# Altium project GSH_Bed_v1.0.PrjPcb
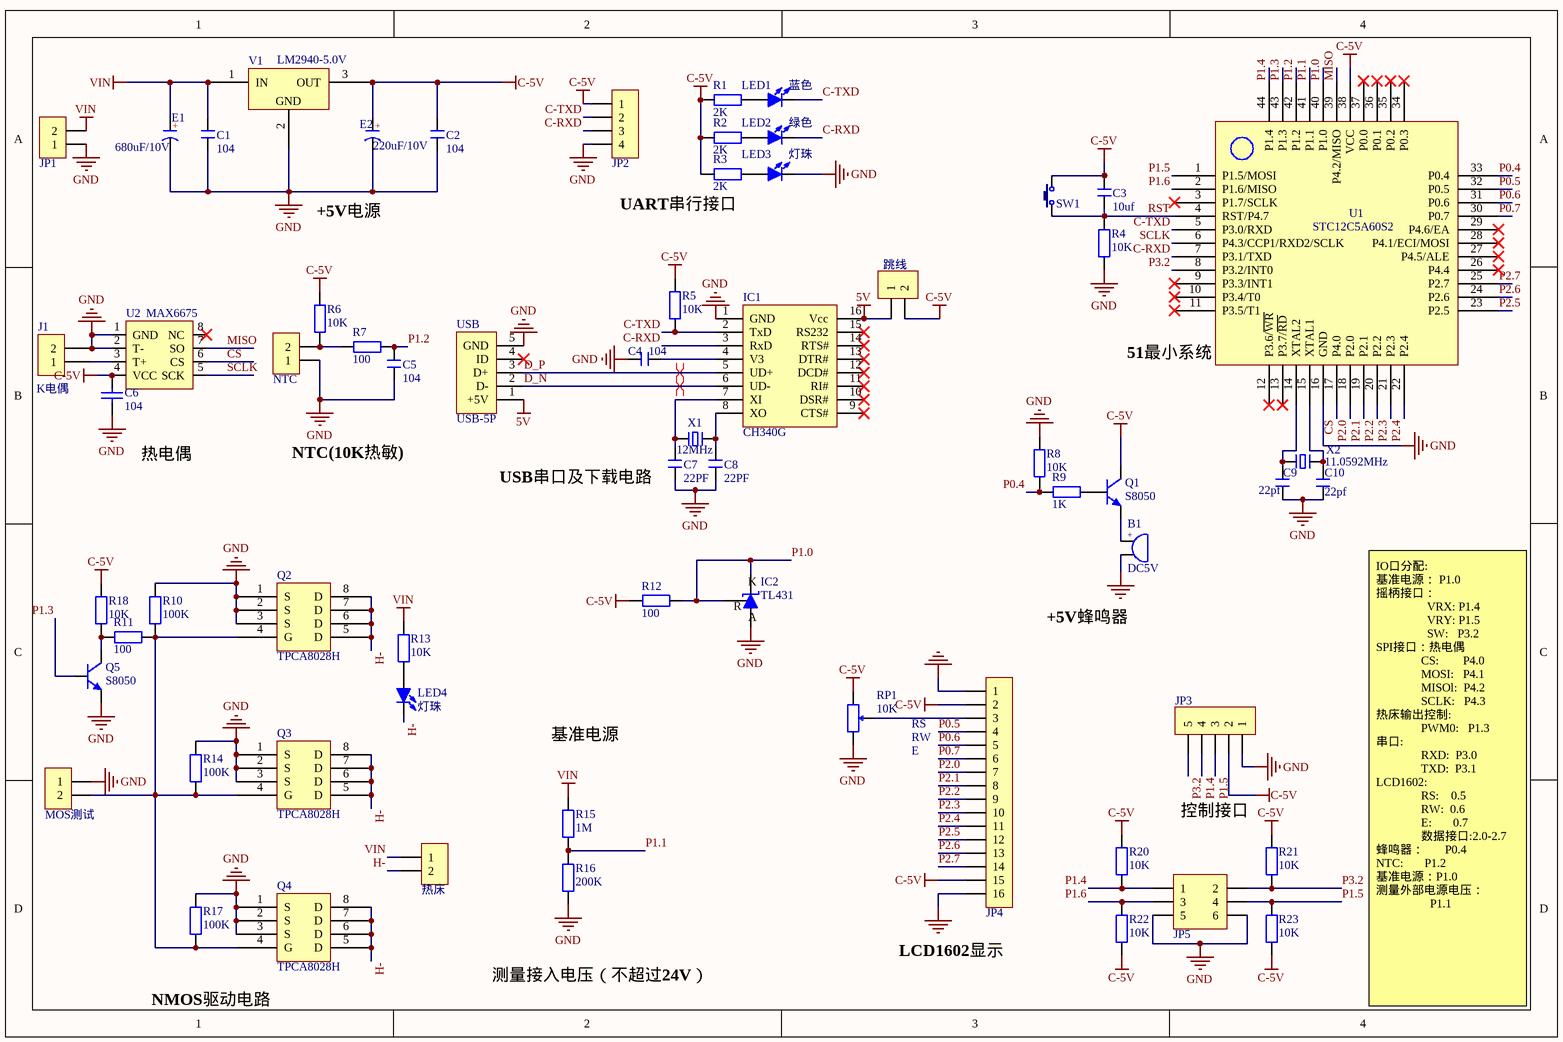
[diagram p0: GSH_Bed_V1.0.SchDoc]
1 sheet, 64 parts. Net scope: global (net labels, ports and power ports of the same name join across sheets).
Board file: GSH_Bed_V1.0.PcbDoc

## Sheet GSH_Bed_V1.0.SchDoc
size A4; SheetNumber: 1; SheetTotal: 1

### Parts
B1  DC5V  [Buzzer]
C1  104  [C 0805]
C2  104  [C 0805]
C3  10uf  [C 0603]
C4  104  [C 0603]
C5  104  [C 0603]
C6  104  [C 0603]
C7  22PF  [C 0603]
C8  22PF  [C 0603]
C9  22pf  [C 0603]
C10  22pf  [C 0603]
E1  680uF/10V  [CM F(10*10.2)]
E2  220uF/10V  [CM D(6.3*5.4)]
IC1  CH340G  [SOP16_N]
IC2  TL431  [SOT23-3L]
J1  K电偶  [HDR-1x2]
JP1  HDR-1X2  [KF2EDGK5.0-2P]  (value not drawn)
JP2  HDR-1X4  [HDR-1X4]  (value not drawn)
JP3  HDR-1X5  [XH2.54-5P]  (value not drawn)
JP4  HDR-1X16  [LCD-1602]  (value not drawn)
JP5  Header3X2  [HDR-3X2]  (value not drawn)
LED1  蓝色  [LED 0603B]
LED2  绿色  [LED 0603G]
LED3  灯珠  [LED 3MM-R]
LED4  灯珠  [LED 3MM-R]
MOS测试  HDR-1X2  [HDR-1X2]  (value not drawn)
NTC  HDR-1X2  [XH2.54-2P]  (value not drawn)
Q1  S8050  [SOT23-3N]
Q2  TPCA8028H  [MOS]
Q3  TPCA8028H  [MOS]
Q4  TPCA8028H  [MOS]
Q5  S8050  [SOT23-3N]
R1  2K  [R 0603-HP]
R2  2K  [R 0603-HP]
R3  2K  [R 0603-HP]
R4  10K  [R 0603-HP]
R5  10K  [R 0603-HP]
R6  10K  [R 0603-HP]
R7  100  [R 0603-HP]
R8  10K  [R 0603-HP]
R9  1K  [R 0603-HP]
R10  100K  [R 0603-HP]
R11  100  [R 0603-HP]
R12  100  [R 0603-HP]
R13  10K  [R 0603-HP]
R14  100K  [R 0603-HP]
R15  1M  [R 0603-HP]
R16  200K  [R 0603-HP]
R17  100K  [R 0603-HP]
R18  10K  [R 0603-HP]
R20  10K  [R 0603-HP]
R21  10K  [R 0603-HP]
R22  10K  [R 0603-HP]
R23  10K  [R 0603-HP]
RP1  10K  [RM065]
SW1  3x6x5  [TSW SMD-3*6*2.5]  (value not drawn)
U1  STC12C5A60S2  [LQFP44 10X10_L]
U2  MAX6675  [SOP8_L]
USB  USB-5P  [USB-MICRO_A]
V1  LM2940-5.0V  [TO252]
X1  12MHz  [XTAL-49S DIP]
X2  11.0592MHz  [XTAL-49S DIP]
热床  HDR-1X2  [KF2EDGK5.0-2P]  (value not drawn)
跳线  HDR-1X2  [HDR-1X2]  (value not drawn)

### Nets
5V: IC1.16(Vcc) USB.1(+5V) 跳线.1
C-5V: C2.2 C3.2 C6.2 E2.1(A) JP2.1 JP3.2 JP4.2 JP4.15 Q1.3(C) R1.2 R2.2 R3.2 R5.2 R6.2 R12.2 R18.2 R20.2 R21.2 R22.1 R23.1 RP1.1 SW1.2 U1.38(VCC) U2.4(VCC) V1.3(OUT) 跳线.2
GND: B1.2 C1.1 C2.1 C4.1 C5.1 C6.1 C7.2 C8.2 C9.1 C10.1 E1.2(K) E2.2(K) IC1.1(GND) IC2.3(A) J1.2 JP1.1 JP2.4 JP3.1 JP4.1 JP4.16 JP5.5 JP5.6 LED3.2(K) MOS测试.1 NTC.1 Q2.1(S) Q2.2(S) Q2.3(S) Q3.1(S) Q3.2(S) Q3.3(S) Q4.1(S) Q4.2(S) Q4.3(S) Q5.2(E) R4.1 R8.1 R10.2 R14.2 R16.1 R17.2 RP1.3 U1.16(GND) U2.1(GND) U2.2(T-) USB.5(GND) V1.2(GND)
VIN: C1.2 E1.1(A) JP1.2 R13.2 R15.2 V1.1(IN) 热床.1
C-RXD: IC1.3(RxD) JP2.3 LED2.2(K) U1.7(P3.1/TXD)
C-TXD: IC1.2(TxD) JP2.2 LED1.2(K) R5.1 U1.5(P3.0/RXD)
CS: U1.17(P4.0) U2.6(CS)
D_N: IC1.6(UD-) USB.2(D-)
D_P: IC1.5(UD+) USB.3(D+)
H-: LED4.2(K) Q2.5(D) Q2.6(D) Q2.7(D) Q2.8(D) Q3.5(D) Q3.6(D) Q3.7(D) Q3.8(D) Q4.5(D) Q4.6(D) Q4.7(D) Q4.8(D) 热床.2
MISO: U1.39(P4.2/MISO) U2.7(SO)
P0.4: R8.2 R9.1 U1.33(P0.4)
P0.5: JP4.4 U1.32(P0.5)
P0.6: JP4.5 U1.31(P0.6)
P0.7: JP4.6 U1.30(P0.7)
P1.0: IC2.1(R) IC2.2(K) R12.1 U1.40(P1.0)
P1.1: R15.1 R16.2 U1.41(P1.1)
P1.2: C5.2 R7.1 U1.42(P1.2)
P1.3: Q5.1(B) U1.43(P1.3)
P1.4: JP3.4 JP5.1 R20.1 U1.44(P1.4)
P1.5: JP3.3 JP5.4 R23.2 U1.1(P1.5/MOSI)
P1.6: JP5.3 R22.2 U1.2(P1.6/MISO)
P2.0: JP4.7 U1.18(P2.0)
P2.1: JP4.8 U1.19(P2.1)
P2.2: JP4.9 U1.20(P2.2)
P2.3: JP4.10 U1.21(P2.3)
P2.4: JP4.11 U1.22(P2.4)
P2.5: JP4.12 U1.23(P2.5)
P2.6: JP4.13 U1.24(P2.6)
P2.7: JP4.14 U1.25(P2.7)
P3.2: JP3.5 JP5.2 R21.1 U1.8(P3.2/INT0)
RST: C3.1 R4.2 SW1.1 U1.4(RST/P4.7)
SCLK: U1.6(P4.3/CCP1/RXD2/SCLK) U2.5(SCK)
NetB1_1: B1.1 Q1.2(E)
NetC4_2: C4.2 IC1.4(V3)
NetC7_1: C7.1 IC1.7(XI) X1.1
NetC8_1: C8.1 IC1.8(XO) X1.2
NetC9_2: C9.2 U1.14(XTAL2) X2.2
NetC10_2: C10.2 U1.15(XTAL1) X2.1
NetJ1_1: J1.1 U2.3(T+)
NetJP4_3: JP4.3 RP1.2
NetLED1_1: LED1.1(A) R1.1
NetLED2_1: LED2.1(A) R2.1
NetLED3_1: LED3.1(A) R3.1
NetLED4_1: LED4.1(A) R13.1
NetMOS测试_2: MOS测试.2 Q2.4(G) Q3.4(G) Q4.4(G) R10.1 R11.2 R14.1 R17.1
NetNTC_2: NTC.2 R6.1 R7.2
NetQ1_1: Q1.1(B) R9.2
NetQ5_3: Q5.3(C) R11.1 R18.1

Not connected (* = marked no-connect by the designer): IC1 9(CTS#)* 10(DSR#)* 11(RI#)* 12(DCD#)* 13(DTR#)* 14(RTS#)* 15(RS232)*; U1 3(P1.7/SCLK)* 9(P3.3/INT1)* 10(P3.4/T0)* 11(P3.5/T1)* 12(P3.6/~{WR})* 13(P3.7/~{RD})* 26(P4.4)* 27(P4.5/ALE)* 28(P4.1/ECI/MOSI)* 29(P4.6/EA)* 34(P0.3)* 35(P0.2)* 36(P0.1)* 37(P0.0)*; U2 8(NC)*; USB 4(ID)*

### Layout directives
differential pair: D_N, D_P

### Notes on the sheet
- +5V电源
- (near R3) UART串行接口
- (near U1) 51最小系统
- 热电偶
- NTC(10K热敏)
- USB串口及下载电路
- +5V蜂鸣器
- RS
- 基准电源
- RW
- E
- 控制接口
- NMOS驱动电路
- 测量接入电压（不超过24V）
- (near JP4) LCD1602显示
- IO口分配:
  基准电源： P1.0
  摇柄接口：
  VRX: P1.4
  VRY: P1.5
  SW:   P3.2
  SPI接口：热电偶
  CS:        P4.0
  MOSI:   P4.1
  MISOl:  P4.2
  SCLK:   P4.3
  热床输出控制:
  PWM0:   P1.3
  串口:
  RXD:  P3.0
  TXD:  P3.1
  LCD1602:
  RS:    0.5
  RW:  0.6
  E:       0.7
  数据接口:2.0-2.7
  蜂鸣器：       P0.4
  NTC:       P1.2
  基准电源：P1.0
  测量外部电源电压：
  P1.1
- (in symbol BEEP) +
- (in symbol C-CM) +

### Library data of the parts
B1 = BEEP: 蜂鸣器; 版权归属: 源创客; BOM名称: 蜂鸣器; 学习资源: www.ooocke.com
C1-C5 C7-C10 = C: 无极性贴片电容; 版权归属: 源创客; BOM名称: 无极性贴片电容; 学习资源: www.ooocke.com
C6 = Cap: Capacitor; Value: 100pF; Published: 8-Jun-2000; LatestRevisionDate: 17-Jul-2002; LatestRevisionNote: Re-released for DXP Platform.; PackageReference: RAD-0.3; Publisher: Altium Limited
E1 E2 = C-CM: 贴片电解电容; 版权归属: 源创客; BOM名称: 贴片电解电容; 学习资源: www.ooocke.com
IC1 = CH340G: 串口转USB; 版权归属: 源创客; BOM名称: 串口转USB; 学习资源: www.ooocke.com
IC2 = TL431-ID: 可调基准稳压芯片; 版权归属: 源创客; BOM名称: 可调基准稳压芯片; 学习资源: www.ooocke.com
J1 = CON2: Connector
JP1 MOS测试 NTC 热床 跳线 = Header 2: 2P接插件; 版权归属: 源创客; BOM名称: 2P接插件; 学习资源: www.ooocke.com
JP2 = Header 4: 4P接插件; 版权归属: 源创客; BOM名称: 4P接插件; 学习资源: www.ooocke.com
JP3 = Header 5: 5P接插件; 版权归属: 源创客; BOM名称: 5P接插件; 学习资源: www.ooocke.com
JP4 = Header 16: 16P接插件; 版权归属: 源创客; BOM名称: 16P接插件; 学习资源: www.ooocke.com
JP5 = Header 3X2: 3*2P接插件; 版权归属: 源创客; BOM名称: 3*2P接插件; 学习资源: www.ooocke.com
LED1 LED2 = LED-SMD: 贴片LED; 版权归属: 源创客; BOM名称: 贴片LED; 学习资源: www.ooocke.com
LED3 LED4 = LED-SMD: 3mm-LED; BOM名称: 贴片LED; 版权归属: 源创客; 学习资源: www.ooocke.com
Q1 Q5 = 8050-SMD: 高频放大-NPN型; 版权归属: 源创客; 属性: 40V 1.5A 1W 100MHZ; BOM名称: 高频放大-NPN型; 学习资源: www.ooocke.com
Q2-Q4 = AON7544: n-mos
R1-R18 R20-R23 = R: 贴片电阻; 版权归属: 源创客; BOM名称: 贴片电阻; 学习资源: www.ooocke.com
RP1 = RP-ID: 插件单联电位器; BOM名称: 插件电位器; 版权归属: 源创客; 学习资源: www.ooocke.com
SW1 = TSW 3x6: 3x6轻触开关; 版权归属: 源创客; BOM名称: 3x6轻触开关; 学习资源: www.ooocke.com
U1 = U?
U2 = MAX6675: K电偶转换
USB = USB-5P: 微型USB母座; 版权归属: 源创客; BOM名称: 微型USB母座; 学习资源: www.ooocke.com
V1 = LM2940: 5V稳压芯片; 版权归属: 源创客; BOM名称: 5V稳压芯片; 学习资源: www.ooocke.com
X1 X2 = XTAL-2: 2脚晶振; 版权归属: 源创客; BOM名称: 2脚晶振; 学习资源: www.ooocke.com